# Altium schematic sheet P07_DDR3.SchDoc
size A
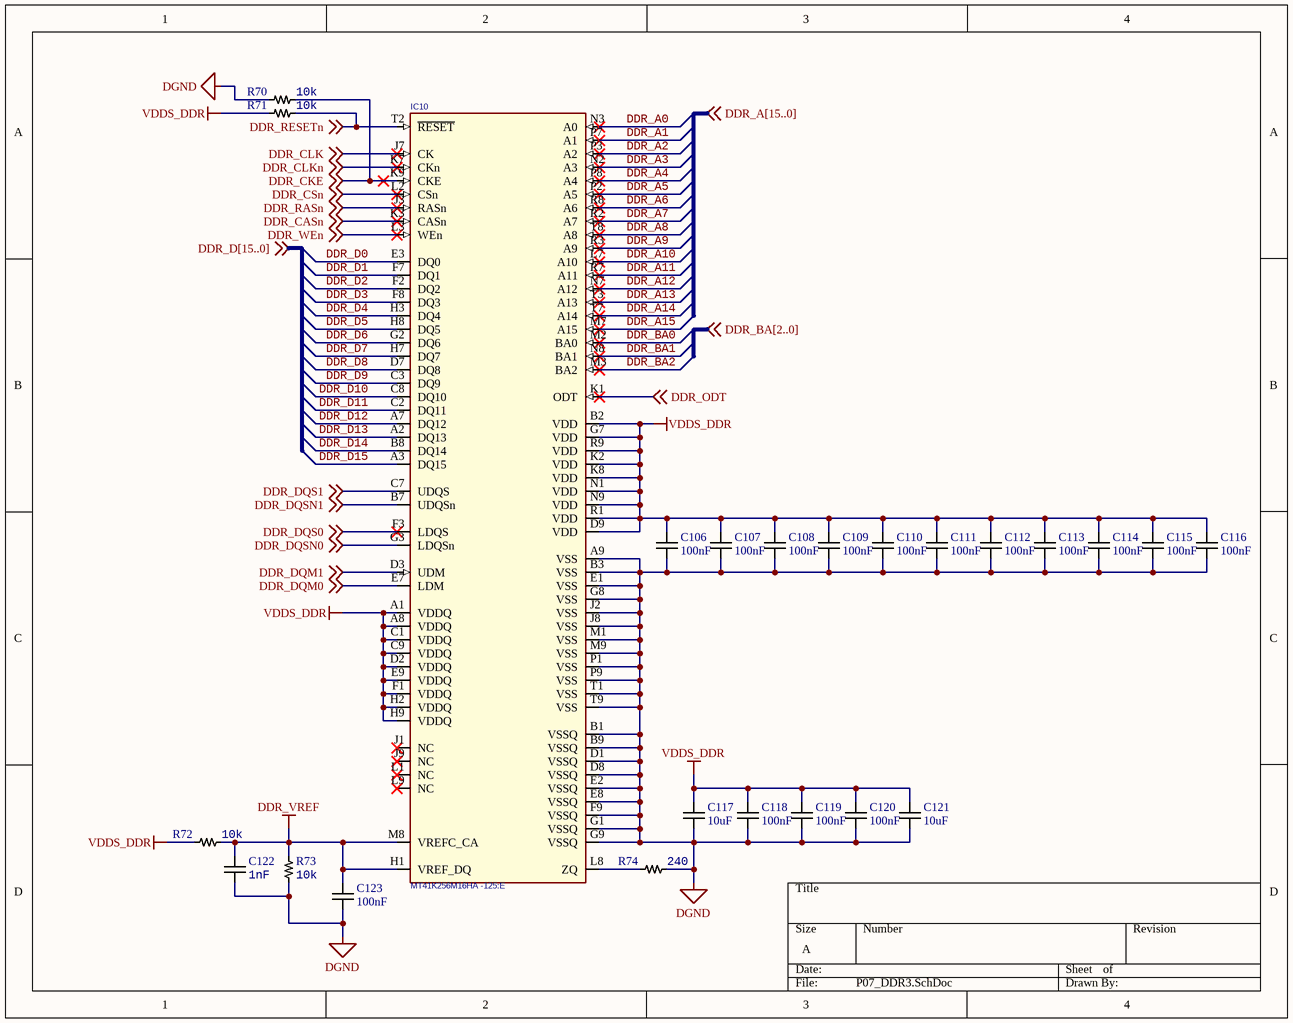
[diagram p0: P07_DDR3.SchDoc]

## Parts
C106  Capacitance: 100nF  [CAP0402]  (hidden comment: C0402C104K4RACTU)
C107  Capacitance: 100nF  [CAP0402]  (hidden comment: C0402C104K4RACTU)
C108  Capacitance: 100nF  [CAP0402]  (hidden comment: C0402C104K4RACTU)
C109  Capacitance: 100nF  [CAP0402]  (hidden comment: C0402C104K4RACTU)
C110  Capacitance: 100nF  [CAP0402]  (hidden comment: C0402C104K4RACTU)
C111  Capacitance: 100nF  [CAP0402]  (hidden comment: C0402C104K4RACTU)
C112  Capacitance: 100nF  [CAP0402]  (hidden comment: C0402C104K4RACTU)
C113  Capacitance: 100nF  [CAP0402]  (hidden comment: C0402C104K4RACTU)
C114  Capacitance: 100nF  [CAP0402]  (hidden comment: C0402C104K4RACTU)
C115  Capacitance: 100nF  [CAP0402]  (hidden comment: C0402C104K4RACTU)
C116  Capacitance: 100nF  [CAP0402]  (hidden comment: C0402C104K4RACTU)
C117  Capacitance: 10uF  [CAP0805]  (hidden comment: C2012X6S1A106K085AC)
C118  Capacitance: 100nF  [CAP0402]  (hidden comment: C0402C104K4RACTU)
C119  Capacitance: 100nF  [CAP0402]  (hidden comment: C0402C104K4RACTU)
C120  Capacitance: 100nF  [CAP0402]  (hidden comment: C0402C104K4RACTU)
C121  Capacitance: 10uF  [CAP0805]  (hidden comment: C2012X6S1A106K085AC)
C122  Capacitance: 1nF  [CAP0402]  (hidden comment: CC0402KRX7R9BB102)
C123  Capacitance: 100nF  [CAP0402]  (hidden comment: C0402C104K4RACTU)
IC10  MT41K256M16HA -125:E  [BGA96_T9_P8_9X14]
R70  Resistance: 10k  [RES0402]  (hidden comment: RC0402FR-0710KL)
R71  Resistance: 10k  [RES0402]  (hidden comment: RC0402FR-0710KL)
R72  Resistance: 10k  [RES0402]  (hidden comment: RC0402FR-0710KL)
R73  Resistance: 10k  [RES0402]  (hidden comment: RC0402FR-0710KL)
R74  Resistance: 240  [RES0402]  (hidden comment: RC0402FR-07240RL)

## Nets
DDR_VREF: C122.1 C123.1 IC10.H1(VREF_DQ) IC10.M8(VREFC_CA) R72.1 R73.2
DGND: C106.2 C107.2 C108.2 C109.2 C110.2 C111.2 C112.2 C113.2 C114.2 C115.2 C116.2 C117.1 C118.2 C119.2 C120.2 C121.1 C122.2 C123.2 IC10.A9(VSS) IC10.B1(VSSQ) IC10.B3(VSS) IC10.B9(VSSQ) IC10.D1(VSSQ) IC10.D8(VSSQ) IC10.E1(VSS) IC10.E2(VSSQ) IC10.E8(VSSQ) IC10.F9(VSSQ) IC10.G1(VSSQ) IC10.G8(VSS) IC10.G9(VSSQ) IC10.J2(VSS) IC10.J8(VSS) IC10.M1(VSS) IC10.M9(VSS) IC10.P1(VSS) IC10.P9(VSS) IC10.T1(VSS) IC10.T9(VSS) R70.2 R73.1 R74.2
VDDS_DDR: C106.1 C107.1 C108.1 C109.1 C110.1 C111.1 C112.1 C113.1 C114.1 C115.1 C116.1 C117.2 C118.1 C119.1 C120.1 C121.2 IC10.A1(VDDQ) IC10.A8(VDDQ) IC10.B2(VDD) IC10.C1(VDDQ) IC10.C9(VDDQ) IC10.D2(VDDQ) IC10.D9(VDD) IC10.E9(VDDQ) IC10.F1(VDDQ) IC10.G7(VDD) IC10.H2(VDDQ) IC10.H9(VDDQ) IC10.K2(VDD) IC10.K8(VDD) IC10.N1(VDD) IC10.N9(VDD) IC10.R1(VDD) IC10.R9(VDD) R71.2 R72.2
DDR_A0: IC10.N3(A0)
DDR_A1: IC10.P7(A1)
DDR_A2: IC10.P3(A2)
DDR_A3: IC10.N2(A3)
DDR_A4: IC10.P8(A4)
DDR_A5: IC10.P2(A5)
DDR_A6: IC10.R8(A6)
DDR_A7: IC10.R2(A7)
DDR_A8: IC10.T8(A8)
DDR_A9: IC10.R3(A9)
DDR_A10: IC10.L7(A10)
DDR_A11: IC10.R7(A11)
DDR_A12: IC10.N7(A12)
DDR_A13: IC10.T3(A13)
DDR_A14: IC10.T7(A14)
DDR_A15: IC10.M7(A15)
DDR_BA0: IC10.M2(BA0)
DDR_BA1: IC10.N8(BA1)
DDR_BA2: IC10.M3(BA2)
DDR_CASn: IC10.K3(CASn) ; off-sheet DDR_CASn
DDR_CKE: IC10.K9(CKE) R70.1 ; off-sheet DDR_CKE
DDR_CLK: IC10.J7(CK) ; off-sheet DDR_CLK
DDR_CLKn: IC10.K7(CKn) ; off-sheet DDR_CLKn
DDR_CSn: IC10.L2(CSn) ; off-sheet DDR_CSn
DDR_D0: IC10.E3(DQ0)
DDR_D1: IC10.F7(DQ1)
DDR_D2: IC10.F2(DQ2)
DDR_D3: IC10.F8(DQ3)
DDR_D4: IC10.H3(DQ4)
DDR_D5: IC10.H8(DQ5)
DDR_D6: IC10.G2(DQ6)
DDR_D7: IC10.H7(DQ7)
DDR_D8: IC10.D7(DQ8)
DDR_D9: IC10.C3(DQ9)
DDR_D10: IC10.C8(DQ10)
DDR_D11: IC10.C2(DQ11)
DDR_D12: IC10.A7(DQ12)
DDR_D13: IC10.A2(DQ13)
DDR_D14: IC10.B8(DQ14)
DDR_D15: IC10.A3(DQ15)
DDR_DQM0: IC10.E7(LDM) ; off-sheet DDR_DQM0
DDR_DQM1: IC10.D3(UDM) ; off-sheet DDR_DQM1
DDR_DQS0: IC10.F3(LDQS) ; off-sheet DDR_DQS0
DDR_DQS1: IC10.C7(UDQS) ; off-sheet DDR_DQS1
DDR_DQSN0: IC10.G3(LDQSn) ; off-sheet DDR_DQSN0
DDR_DQSN1: IC10.B7(UDQSn) ; off-sheet DDR_DQSN1
DDR_ODT: IC10.K1(ODT) ; off-sheet DDR_ODT
DDR_RASn: IC10.J3(RASn) ; off-sheet DDR_RASn
DDR_RESETn: IC10.T2(~{RESET}) R71.1 ; off-sheet DDR_RESETn
DDR_WEn: IC10.L3(WEn) ; off-sheet DDR_WEn
NetIC10_L8: IC10.L8(ZQ) R74.1

Not connected (* = marked no-connect by the designer): IC10 J1(NC)* J9(NC)* L1(NC)* L9(NC)*

## Library data of the parts
C106-C116 C118-C120 C123 = CAP_100nF: MLCC 100nF 0402 SMD; Manufacturer: KEMET; Tolerance: 10%; Voltage Rating (DC): 16V; Dielectric: X7R; Dissipation Factor: 3.5%; Supplier 1: Digi-Key; Supplier Part Number 1: 399-3521-1-ND; Manufacturer Part Number: C0402C104K4RACTU; RoHS: Yes; Stock 1: 6512243; Pricing 1: 1=0.10000, 10=0.04200, 100=0.01860, 500=0.01328, 1000=0.01044, 2500=0.00949, 5000=0.00873 (USD); Packaging: Tape and Reel; Mount: Surface Mount; Case/Package: 0402; Case Code (Imperial): 0402; Case Code (Metric): 1005; Contact Plating: Tin,Matte; Min Operating Temperature: -55°C; Max Operating Temperature: 125°C; Package Quantity: 10000; Voltage Rating: 16V; Termination: SMD/SMT; Length: 1mm; Height: 0.5mm; Width: 0.5mm; Depth: 0.5mm; Radiation Hardening: No; ComponentLink2URL: https://datasheet.ciiva.com/18192/getdatasheetpartid-385384-18192412.pdf?src-supplier=Verical; ComponentLink2Description: Datasheet
C117 C121 = CAP_10uF: MLCC 10uF 0805 SMD; Manufacturer: TDK; Tolerance: 10%; Dielectric Material: Ceramic; Voltage Rating: 10V; Dielectric: X6S; Supplier 1: Digi-Key; Supplier Part Number 1: 445-7613-1-ND; Manufacturer Part Number: C2012X6S1A106K085AC; RoHS: Yes; Stock 1: 46852; Pricing 1: 1=0.30000, 10=0.20500, 100=0.11610, 500=0.08198, 1000=0.07173 (USD); Packaging: Tape and Reel; Mount: Surface Mount; Case/Package: 0805; Weight: 0.000194oz; Case Code (Metric): 2012; Case Code (Imperial): 0805; Min Operating Temperature: -55°C; Max Operating Temperature: 105°C; Termination: SMD/SMT; Package Quantity: 4000; Voltage Rating (DC): 10V; Composition: Ceramic; Length: 2mm; Height: 1.25mm; Depth: 1.25mm; Width: 0.049inch; Thickness: 0.037inch; REACH SVHC: No SVHC; Lead Free: Lead Free; ComponentLink3URL: https://datasheet.ciiva.com/6290/tdkmlcccaprange-6290501.pdf?src-supplier=Digi-Key; ComponentLink3Description: Datasheet
C122 = CAP_1nF: MLCC 1nF 0402 SMD; Manufacturer: Yageo; Dielectric Material: Ceramic; Tolerance: 10%; Voltage Rating: 50V; Insulation Resistance: 100GR; Supplier 1: Digi-Key; Manufacturer Part Number: CC0402KRX7R9BB102; Stock 1: 3539064; Pricing 1: 1=0.10000, 10=0.02100, 100=0.00920, 500=0.00654, 1000=0.00514, 2500=0.00468, 5000=0.00430 (USD); RoHS: Yes; Mount: Surface Mount; Case/Package: 0402; Case Code (Metric): 1005; Case Code (Imperial): 0402; Min Operating Temperature: -55°C; Max Operating Temperature: 125°C; Packaging: Tape and Reel; Length: 0.039inch; Width: 0.02inch; Thickness: 0.022inch; Lead Free: Lead Free; Halogen Free: Halogen Free; ComponentLink1URL: https://datasheet.ciiva.com/11786/0900766b8079c870-11786157.pdf?src-supplier=RSComponents; ComponentLink1Description: https://datasheet.ciiva.com/11786/0900766b8079c870-11786157.pdf?src-supplier=RSComponents; ComponentLink2URL: https://datasheet.ciiva.com/143/mlccorderingcode-143956.pdf?src-supplier=Digi-Key; ComponentLink2Description: https://datasheet.ciiva.com/143/mlccorderingcode-143956.pdf?src-supplier=Digi-Key; ComponentLink3URL: https://datasheet.ciiva.com/143/mlccorderingcode-143957.pdf?src-supplier=Digi-Key; ComponentLink3Description: https://datasheet.ciiva.com/143/mlccorderingcode-143957.pdf?src-supplier=Digi-Key; ComponentLink4URL: https://datasheet.ciiva.com/143/mlccorderingcode-143958.pdf?src-supplier=Digi-Key; ComponentLink4Description: https://datasheet.ciiva.com/143/mlccorderingcode-143958.pdf?src-supplier=Digi-Key; ComponentLink5URL: https://datasheet.ciiva.com/13389/upy-gp-np0-16v-to-50v-8-13389974.pdf?src-supplier=Mouser; ComponentLink5Description: https://datasheet.ciiva.com/13389/upy-gp-np0-16v-to-50v-8-13389974.pdf?src-supplier=Mouser; ComponentLink6URL: https://datasheet.ciiva.com/16625/upy-gphc-x7r-6-3v-to-50v-8-16625512.pdf?src-supplier=Avnet+Europe; ComponentLink6Description: https://datasheet.ciiva.com/16625/upy-gphc-x7r-6-3v-to-50v-8-16625512.pdf?src-supplier=Avnet+Europe; ComponentLink7URL: https://datasheet.ciiva.com/15189/getdatasheetpartid-403474-15189131.pdf?src-supplier=Verical; ComponentLink7Description: https://datasheet.ciiva.com/15189/getdatasheetpartid-403474-15189131.pdf?src-supplier=Verical; ComponentLink8URL: https://datasheet.ciiva.com/7978/1489800-7978092.pdf?src-supplier=Element14; ComponentLink8Description: https://datasheet.ciiva.com/7978/1489800-7978092.pdf?src-supplier=Element14; ComponentLink9URL: https://datasheet.ciiva.com/22749/1489800-22749213.pdf?src-supplier=Element14; ComponentLink9Description: https://datasheet.ciiva.com/22749/1489800-22749213.pdf?src-supplier=Element14
IC10 = MT41K256M16HA: DDR2 SDRAM 2Gb (256Mx8); Manufacturer: Micron Technology; Lead Time: 0 weeks; Peak Solder Temperature: 260 deg C; Supplier 1: Arrow; Supplier Part Number 1: 52128708S9959891N2406; Manufacturer Part Number: MT41K256M16HA-125:E; RoHS: CHINA ROHS: Compliant / EU ROHS: Compliant; Stock 1: 0; Pricing 1: 0=10.09 (USD); Package Quantity: 1; Termination Finish: Sn/Ag/Cu; China ROHS Lead (X -> above / O -> below threshold): O; China ROHS Mercury (X -> above / O -> below threshold): O; China ROHS Cadmium (X -> above / O -> below threshold): O; China ROHS Hex Chromium (X -> above / O -> below threshold): O; China ROHS PBB (X -> above / O -> below threshold): O; China ROHS PBDE (X -> above / O -> below threshold): O; EU_ROHS_PROD_EXEMPTION_BY_SUPP: N/R; ComponentLink1URL: http://components.arrow.com/partservice/dataview/altium/52128708S9959891N2406?apiKey=aa438727d59eed98c4bed826d8d949c84cb5e685b92bf87346a0226bd2658797; ComponentLink1Description: http://components.arrow.com/partservice/dataview/altium/52128708S9959891N2406?apiKey=aa438727d59eed98c4bed826d8d949c84cb5e685b92bf87346a0226bd2658797
R70-R73 = RES_10k: Resistor 10kOhm 0402 SMD; Manufacturer: Yageo; Temperature Coefficient: 100ppm/°C; Tolerance: 1%; Voltage Rating (DC): 50V; Power Rating: 62.5mW; ComponentLink1Description: https://datasheet.ciiva.com/7660/38568-7660787.pdf?src-supplier=Element14; ComponentLink1URL: https://datasheet.ciiva.com/7660/38568-7660787.pdf?src-supplier=Element14; Composition: Thick Film; Height: 0.32mm; Manufacturer Part Number: RC0402FR-0710KL; Number of Terminations: 2; Packaging: Tape and Reel; Pricing 1: 1=0.10000, 10=0.01500, 100=0.00600, 1000=0.00270, 2500=0.00235, 5000=0.00194 (USD); RoHS: Yes; Stock 1: 72891652; Supplier 1: Digi-Key; Case/Package: 0402; Number of Pins: 2; Case Code (Imperial): 0402; Case Code (Metric): 1005; Min Operating Temperature: -55°C; Max Operating Temperature: 155°C; Voltage Rating: 50V; Termination: SMD/SMT; Military Standard: Not; Working Voltage: 50V; Length: 1mm; Width: 0.5mm; Depth: 0.5mm; Lead Pitch: 0.2mm; REACH SVHC: No SVHC; Lead Free: Lead Free; ComponentLink2URL: https://datasheet.ciiva.com/7983/1018594-7983486.pdf?src-supplier=Element14; ComponentLink2Description: https://datasheet.ciiva.com/7983/1018594-7983486.pdf?src-supplier=Element14; ComponentLink3URL: https://datasheet.ciiva.com/7849/1784430-7849813.pdf?src-supplier=Element14; ComponentLink3Description: https://datasheet.ciiva.com/7849/1784430-7849813.pdf?src-supplier=Element14; ComponentLink4URL: https://datasheet.ciiva.com/7849/1686128-7849814.pdf?src-supplier=Element14; ComponentLink4Description: https://datasheet.ciiva.com/7849/1686128-7849814.pdf?src-supplier=Element14; ComponentLink5URL: https://datasheet.ciiva.com/7849/1784430-7849815.pdf?src-supplier=Element14; ComponentLink5Description: https://datasheet.ciiva.com/7849/1784430-7849815.pdf?src-supplier=Element14; ComponentLink6URL: https://datasheet.ciiva.com/22747/1018594-22747512.pdf?src-supplier=Element14; ComponentLink6Description: https://datasheet.ciiva.com/22747/1018594-22747512.pdf?src-supplier=Element14; ComponentLink7URL: https://datasheet.ciiva.com/12667/pyu-rc0402-51-rohs-l-6-r-12667067.pdf?src-supplier=Mouser; ComponentLink7Description: https://datasheet.ciiva.com/12667/pyu-rc0402-51-rohs-l-6-r-12667067.pdf?src-supplier=Mouser
R74 = RES_240: Resistor 240Ohm 0402 SMD; Manufacturer: Yageo Phycomp; Temperature Coefficient: 100ppm/°C; Tolerance: 1%; Power Rating: 63mW; Voltage Rating (DC): 50V; Supplier 1: Digi-Key; Manufacturer Part Number: RC0402FR-07240RL; RoHS: Yes; Stock 1: 5154046; Pricing 1: 1=0.10000, 10=0.01600, 100=0.00640, 1000=0.00289, 2500=0.00251, 5000=0.00207 (USD); Height: 0.32mm; Packaging: Cut Tape; ComponentLink1URL: http://www.mouser.com/ds/2/447/PYu-RC0402_51_RoHS_L_6_r-8721.pdf?src-supplier=Mouser; ComponentLink1Description: http://www.mouser.com/ds/2/447/PYu-RC0402_51_RoHS_L_6_r-8721.pdf?src-supplier=Mouser; Mount: Surface Mount; Case/Package: 0402; Number of Pins: 2; Min Operating Temperature: -55°C; Max Operating Temperature: 155°C; Length: 1mm; Depth: 0.5mm; REACH SVHC: No SVHC; Lead Free: Lead Free; ComponentLink2URL: http://www.farnell.com/datasheets/2167052.pdf?src-supplier=Farnell; ComponentLink2Description: http://www.farnell.com/datasheets/2167052.pdf?src-supplier=Farnell; ComponentLink3URL: http://www.yageo.com/documents/recent/PYu-RC_Group_51_RoHS_L_9.pdf?src-supplier=Digi-Key; ComponentLink3Description: http://www.yageo.com/documents/recent/PYu-RC_Group_51_RoHS_L_9.pdf?src-supplier=Digi-Key; ComponentLink4URL: http://www.yageo.com/documents/recent/PYu-RC_Group_51_RoHS_L_10.pdf?src-supplier=Digi-Key; ComponentLink4Description: http://www.yageo.com/documents/recent/PYu-RC_Group_51_RoHS_L_10.pdf?src-supplier=Digi-Key; ComponentLink5URL: http://www.farnell.com/datasheets/2167052.pdf?src-supplier=Element14; ComponentLink5Description: http://www.farnell.com/datasheets/2167052.pdf?src-supplier=Element14